# Altium schematic sheet BottomPanel.SchDoc
size A3; SheetNumber: 3; SheetTotal: 3
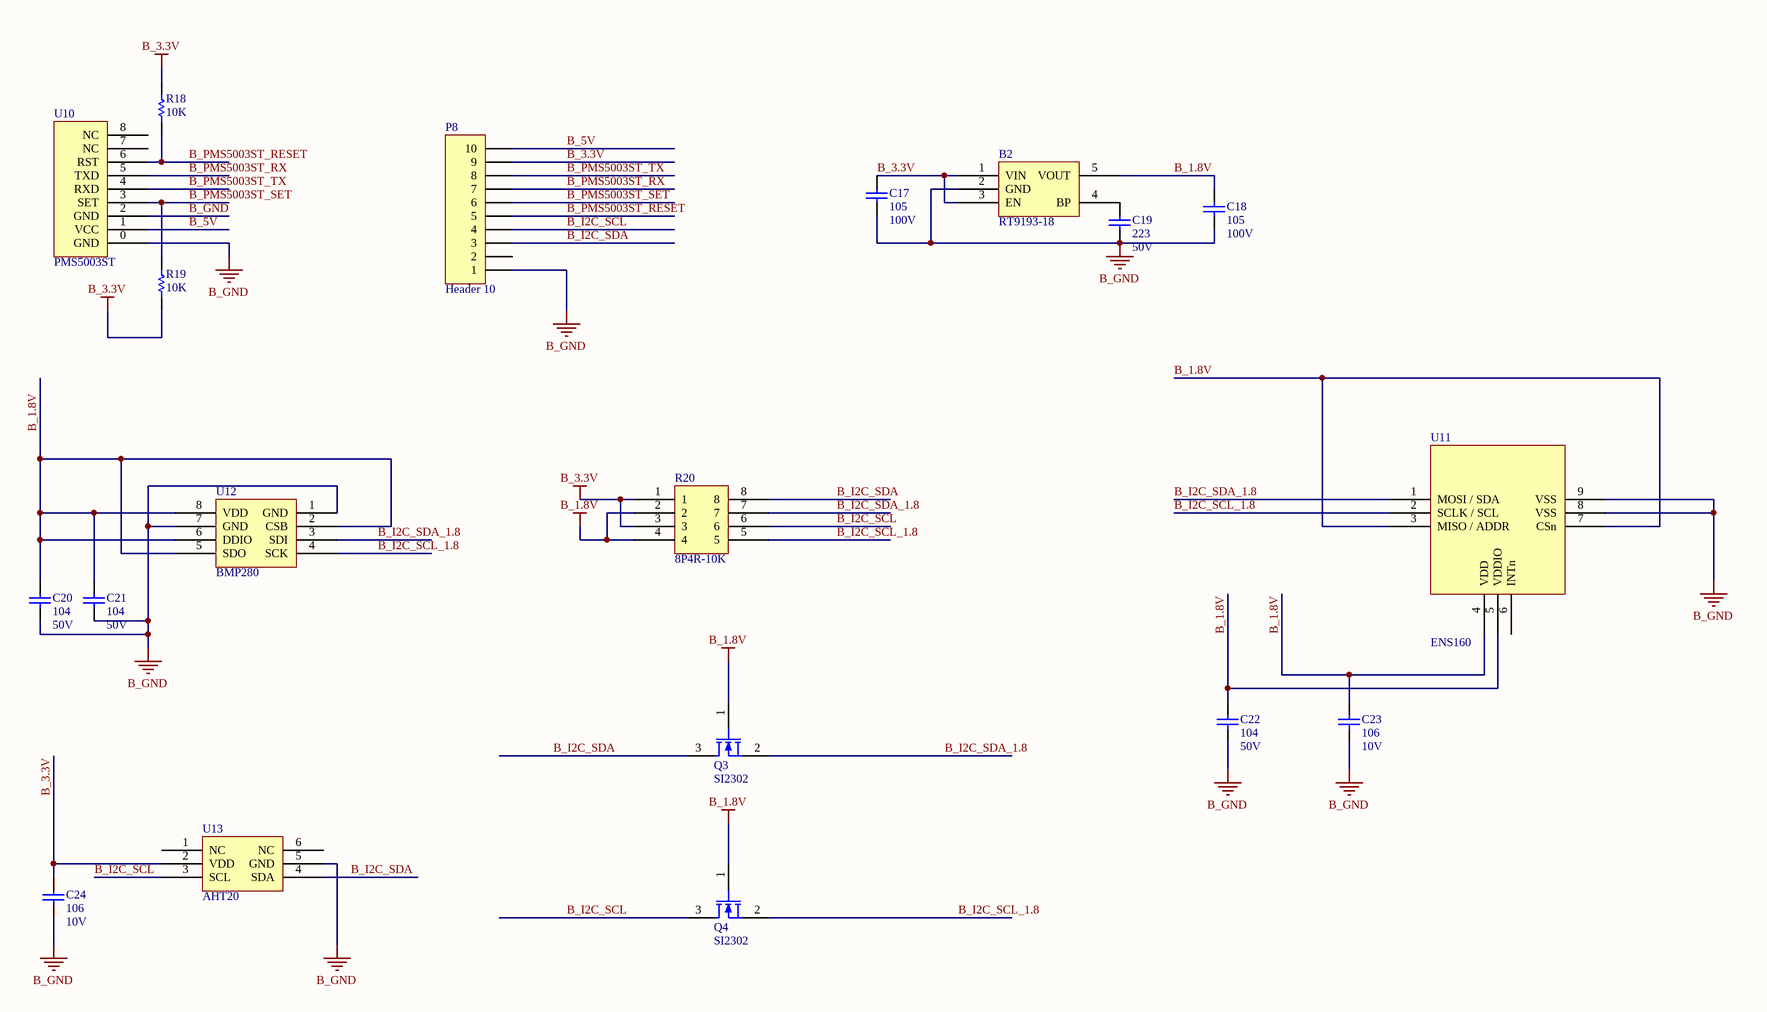
[diagram p0: BottomPanel.SchDoc]

## Parts
B2  RT9193-18  [SOT23-5AL]
C17  100V  value 105  [CAPC2012L]
C18  100V  value 105  [CAPC2012L]
C19  50V  value 223  [CAPC1608L]
C20  50V  value 104  [CAPC1608L]
C21  50V  value 104  [CAPC1608L]
C22  50V  value 104  [CAPC1608L]
C23  10V  value 106  [CAPC1608L]
C24  10V  value 106  [CAPC1608L]
P8  Header 10  [XH254-W-10P]
Q3  SI2302  [SOT-23B_L]
Q4  SI2302  [SOT-23B_L]
R18  value 10K  [RESC1608L]  (hidden comment: Res1)
R19  value 10K  [RESC1608L]  (hidden comment: Res1)
R20  8P4R-10K  [8P4R 0603]
U10  PMS5003ST  [PMS5003ST]
U11  ENS160  [ENS160]
U12  BMP280  [BMP280]
U13  AHT20  [AHT20]

## Nets
B_1.8V: B2.5(VOUT) C18.2 C20.2 C21.2 C22.2 C23.2 Q3.1(G) Q4.1(G) R20.2 R20.4 U11.3(MISO_/_ADDR) U11.4(VDD) U11.5(VDDIO) U11.7(CSn) U12.2(CSB) U12.5(SDO) U12.6(DDIO) U12.8(VDD)
B_3.3V: B2.1(VIN) B2.3(EN) C17.2 C24.2 P8.9 R18.1 R19.2 R20.1 R20.3 U13.2(VDD)
B_GND: B2.2(GND) C17.1 C18.1 C19.1 C20.1 C21.1 C22.1 C23.1 C24.1 P8.1 U10.0(GND) U10.2(GND) U11.8(VSS) U11.9(VSS) U12.1(GND) U12.7(GND) U13.5(GND)
B_5V: P8.10 U10.1(VCC)
B_I2C_SCL: P8.4 Q4.3(D) R20.6 U13.3(SCL)
B_I2C_SCL_1.8: Q4.2(S) R20.5 U11.2(SCLK_/_SCL) U12.4(SCK)
B_I2C_SDA: P8.3 Q3.3(D) R20.8 U13.4(SDA)
B_I2C_SDA_1.8: Q3.2(S) R20.7 U11.1(MOSI_/_SDA) U12.3(SDI)
B_PMS5003ST_RESET: P8.5 R18.2 U10.6(RST)
B_PMS5003ST_RX: P8.7 U10.5(TXD)
B_PMS5003ST_SET: P8.6 R19.1 U10.3(SET)
B_PMS5003ST_TX: P8.8 U10.4(RXD)
NetB2_4: B2.4(BP) C19.2

Not connected (* = marked no-connect by the designer): P8 2; U10 7(NC) 8(NC); U11 6(INTn); U13 1(NC) 6(NC)

## Library data of the parts
C17-C24 = Cap: Capacitor; Published: 8-Jun-2000; LatestRevisionDate: 17-Jul-2002; LatestRevisionNote: Re-released for DXP Platform.; PackageReference: RAD-0.3; Publisher: Altium Limited; PackageDescription: Radial Cap, Thru-Hole; 2 Leads; 0.3 in Pin Spacing
P8 = Header 10: Header, 10-Pin; LatestRevisionDate: 17-Jul-2002; LatestRevisionNote: Re-released for DXP Platform.; Publisher: Altium Limited
Q3 Q4 = MOSFET-N: N-Channel MOSFET; Published: 8-Jun-2000; LatestRevisionDate: 17-Jul-2002; LatestRevisionNote: Re-released for DXP Platform.; PackageVersion: 1995/1996; PackageReference: E3; Publisher: Altium Limited; PackageDescription: TO, Flat Index; 3 In-Line, Axial Leads; Body Dia. 4.6mm; Lead Dia. 0.5 mm (max)
R18 R19 = Res1: Resistor; Published: 8-Jun-2000; LatestRevisionDate: 17-Jul-2002; LatestRevisionNote: Re-released for DXP Platform.; PackageReference: AXIAL-0.3; Publisher: Altium Limited; PackageDescription: Axial Device, Thru-Hole; 2 Leads; 0.3 in Pin Spacing
R20 = 8P4R